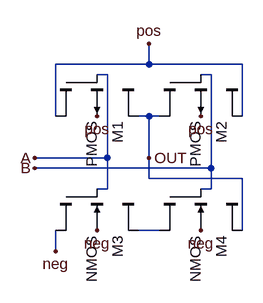
[diagram p0: schematic nandLVS.asc]
nandLVS.asc, the LTspice schematic file:
Version 4
SHEET 1 880 680
WIRE 176 64 176 32
WIRE 176 64 32 64
WIRE 320 64 176 64
WIRE 112 80 96 80
WIRE 272 80 256 80
WIRE 32 144 32 64
WIRE 176 144 160 144
WIRE 192 144 176 144
WIRE 320 144 320 64
WIRE 112 208 112 80
WIRE 112 208 0 208
WIRE 176 208 176 144
WIRE 272 224 272 80
WIRE 272 224 0 224
WIRE 176 240 176 208
WIRE 320 240 176 240
WIRE 112 256 112 208
WIRE 112 256 96 256
WIRE 272 256 272 224
WIRE 272 256 256 256
WIRE 192 320 160 320
WIRE 320 320 320 240
WIRE 32 352 32 320
FLAG 0 208 A
FLAG 0 224 B
FLAG 176 208 OUT
FLAG 176 32 pos
FLAG 96 144 pos
FLAG 256 144 pos
FLAG 32 352 neg
FLAG 96 320 neg
FLAG 256 320 neg
SYMBOL cktsym\\pmos4 96 144 R90
SYMATTR InstName M1
SYMATTR Value2 l=.9u w=6u
SYMBOL cktsym\\pmos4 256 144 R90
SYMATTR InstName M2
SYMATTR Value2 l=.9u w=6u
SYMBOL cktsym\\nmos4 96 320 R90
SYMATTR InstName M3
SYMATTR Value2 l=.9u w=3u
SYMBOL cktsym\\nmos4 256 320 R90
SYMATTR InstName M4
SYMATTR Value2 l=.9u w=3u

The netlist it stands for:
* nandLVS.asc
M1 pos A OUT pos PMOS l=.9u w=6u
M2 OUT B pos pos PMOS l=.9u w=6u
M3 N001 A neg neg NMOS l=.9u w=3u
M4 OUT B N001 neg NMOS l=.9u w=3u
.model NMOS NMOS
.model PMOS PMOS
.lib standard.mos
.backanno
.end